# Altium project S7CAS-PLEIADES-CARTE-MERE-P_07.PrjPcb (part 2 of 2)

## Sheet ADC_1_PLEIADES.SchDoc
size Tabloid; SheetNumber: 9; SheetTotal: 10; Sheet_Name: Insert name in Document Parameters; Size: 11x17
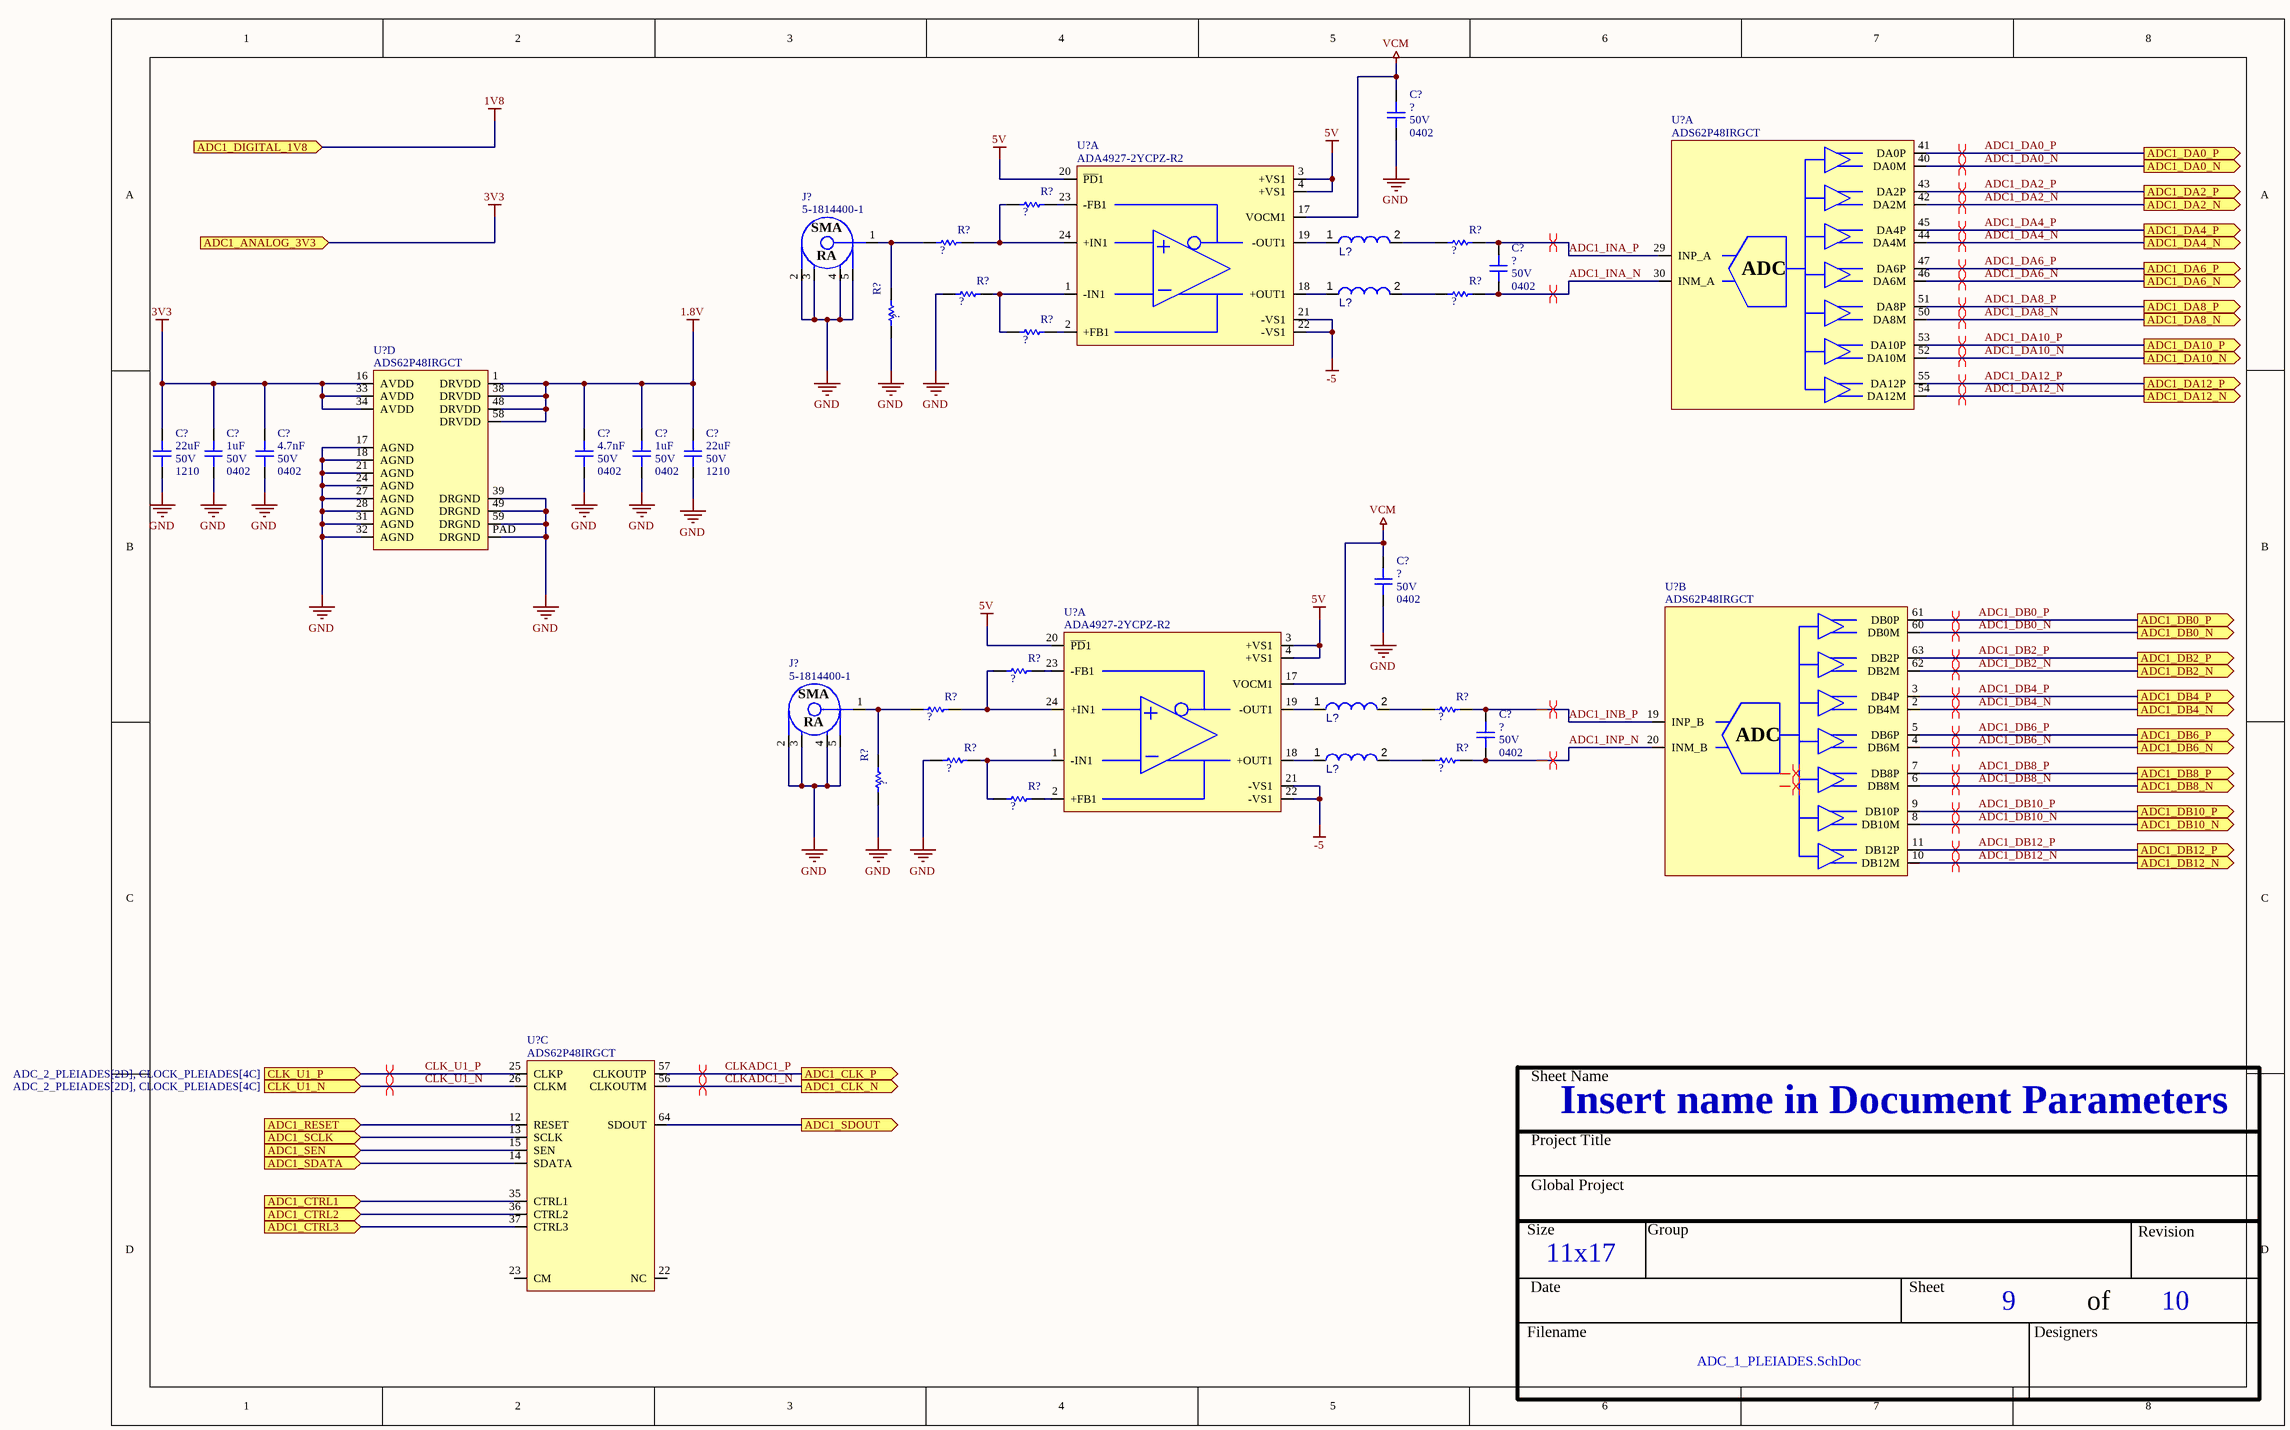
[diagram p7: ADC_1_PLEIADES.SchDoc]

### Parts
(Parts that share a designator on the sheet are numbered #1, #2 ... from top to bottom, then left to right.)
C?#15  Voltage: 50V  Package: 0402  [CAP_0402]  (hidden comment: CAP - 0402)
C?#16  Voltage: 50V  Package: 0402  [CAP_0402]  (hidden comment: CAP - 0402)
C?#17  value 22uF  Voltage: 50V  Package: 1210  [CAP_1210]  (hidden comment: CAP - 1210)
C?#18  value 1uF  Voltage: 50V  Package: 0402  [CAP_0402]  (hidden comment: CAP - 0402)
C?#19  value 4.7nF  Voltage: 50V  Package: 0402  [CAP_0402]  (hidden comment: CAP - 0402)
C?#20  value 4.7nF  Voltage: 50V  Package: 0402  [CAP_0402]  (hidden comment: CAP - 0402)
C?#21  value 1uF  Voltage: 50V  Package: 0402  [CAP_0402]  (hidden comment: CAP - 0402)
C?#22  value 22uF  Voltage: 50V  Package: 1210  [CAP_1210]  (hidden comment: CAP - 1210)
C?#23  Voltage: 50V  Package: 0402  [CAP_0402]  (hidden comment: CAP - 0402)
C?#24  Voltage: 50V  Package: 0402  [CAP_0402]  (hidden comment: CAP - 0402)
J?#2  5-1814400-1  [CONN_SMA_5-1814400-1]
J?#3  5-1814400-1  [CONN_SMA_5-1814400-1]
L?#3  RL622-102K-RC  [INDR62-500-1100X850X1100]  (value not drawn)
L?#4  RL622-102K-RC  [INDR62-500-1100X850X1100]  (value not drawn)
L?#5  RL622-102K-RC  [INDR62-500-1100X850X1100]  (value not drawn)
L?#6  RL622-102K-RC  [INDR62-500-1100X850X1100]  (value not drawn)
R?#5  RES - 0402  [RES_0402]  (value not drawn)
R?#6  RES - 0402  [RES_0402]  (value not drawn)
R?#7  RES - 0402  [RES_0402]  (value not drawn)
R?#8  RES - 0402  [RES_0402]  (value not drawn)
R?#9  RES - 0402  [RES_0402]  (value not drawn)
R?#10  RES - 0402  [RES_0402]  (value not drawn)
R?#11  RES - 0402  [RES_0402]  (value not drawn)
R?#12  RES - 0402  [RES_0402]  (value not drawn)
R?#13  RES - 0402  [RES_0402]  (value not drawn)
R?#14  RES - 0402  [RES_0402]  (value not drawn)
R?#15  RES - 0402  [RES_0402]  (value not drawn)
R?#16  RES - 0402  [RES_0402]  (value not drawn)
R?#17  RES - 0402  [RES_0402]  (value not drawn)
R?#18  RES - 0402  [RES_0402]  (value not drawn)
U?#12  ADS62P48IRGCT  [ADC_ADS62P48IRGCT]  (part A of 4)
U?#13  ADA4927-2YCPZ-R2  [OPAMP_ADA4927-2YCPZ-R2]  (part A of 2)
U?#14  ADS62P48IRGCT  [ADC_ADS62P48IRGCT]  (part D of 4)
U?#15  ADS62P48IRGCT  [ADC_ADS62P48IRGCT]  (part B of 4)
U?#16  ADA4927-2YCPZ-R2  [OPAMP_ADA4927-2YCPZ-R2]  (part A of 2)
U?#17  ADS62P48IRGCT  [ADC_ADS62P48IRGCT]  (part C of 4)

### Ports
ADC1_ANALOG_3V3 (in), ADC1_CLK_N (out), ADC1_CLK_P (out), ADC1_CTRL1 (in), ADC1_CTRL2 (in), ADC1_CTRL3 (in), ADC1_DA0_N (out), ADC1_DA0_P (out), ADC1_DA2_N (out), ADC1_DA2_P (out), ADC1_DA4_N (out), ADC1_DA4_P (out), ADC1_DA6_N (out), ADC1_DA6_P (out), ADC1_DA8_N (out), ADC1_DA8_P (out), ADC1_DA10_N (out), ADC1_DA10_P (out), ADC1_DA12_N (out), ADC1_DA12_P (out), ADC1_DB0_N (out), ADC1_DB0_P (out), ADC1_DB2_N (out), ADC1_DB2_P (out), ADC1_DB4_N (out), ADC1_DB4_P (out), ADC1_DB6_N (out), ADC1_DB6_P (out), ADC1_DB8_N (out), ADC1_DB8_P (out), ADC1_DB10_N (out), ADC1_DB10_P (out), ADC1_DB12_N (out), ADC1_DB12_P (out), ADC1_DIGITAL_1V8 (in), ADC1_RESET (in), ADC1_SCLK (in), ADC1_SDATA (in), ADC1_SDOUT (out), ADC1_SEN (in), CLK_U1_N (in, see ADC_2_PLEIADES[2D], CLOCK_PLEIADES[4C]), CLK_U1_P (in, see ADC_2_PLEIADES[2D], CLOCK_PLEIADES[4C])

### Nets
1.8V: C?#20.2 C?#21.2 C?#22.2 U?#14.1(DRVDD) U?#14.38(DRVDD) U?#14.48(DRVDD) U?#14.58(DRVDD)
1V8: port ADC1_DIGITAL_1V8
3V3: C?#15.1 C?#17.1 C?#17.2 C?#18.1 C?#18.2 C?#19.1 C?#19.2 C?#20.1 C?#21.1 C?#22.1 C?#23.1 J?#2.2 J?#2.3 J?#2.4 J?#2.5 J?#3.2 J?#3.3 J?#3.4 J?#3.5 R?#8.1 R?#10.1 R?#15.1 R?#17.1 U?#14.16(AVDD) U?#14.17(AGND) U?#14.18(AGND) U?#14.21(AGND) U?#14.24(AGND) U?#14.27(AGND) U?#14.28(AGND) U?#14.31(AGND) U?#14.32(AGND) U?#14.33(AVDD) U?#14.34(AVDD) U?#14.39(DRGND) U?#14.49(DRGND) U?#14.59(DRGND) U?#14.PAD(DRGND) ; port ADC1_ANALOG_3V3  [also labelled GND]  [project net +0V75]
5V: U?#13.3(+VS1) U?#13.4(+VS1) U?#13.20(~{PD}1) U?#16.3(+VS1) U?#16.4(+VS1) U?#16.20(~{PD}1)
-5: U?#13.21(-VS1) U?#13.22(-VS1) U?#16.21(-VS1) U?#16.22(-VS1)
VCM: C?#15.2 C?#23.2 U?#13.17(VOCM1) U?#16.17(VOCM1)
ADC1_DA0_N: U?#12.40(DA0M) ; port ADC1_DA0_N
ADC1_DA0_P: U?#12.41(DA0P) ; port ADC1_DA0_P
ADC1_DA2_N: U?#12.42(DA2M) ; port ADC1_DA2_N
ADC1_DA2_P: U?#12.43(DA2P) ; port ADC1_DA2_P
ADC1_DA4_N: U?#12.44(DA4M) ; port ADC1_DA4_N
ADC1_DA4_P: U?#12.45(DA4P) ; port ADC1_DA4_P
ADC1_DA6_N: U?#12.46(DA6M) ; port ADC1_DA6_N
ADC1_DA6_P: U?#12.47(DA6P) ; port ADC1_DA6_P
ADC1_DA8_N: U?#12.50(DA8M) ; port ADC1_DA8_N
ADC1_DA8_P: U?#12.51(DA8P) ; port ADC1_DA8_P
ADC1_DA10_N: U?#12.52(DA10M) ; port ADC1_DA10_N
ADC1_DA10_P: U?#12.53(DA10P) ; port ADC1_DA10_P
ADC1_DA12_N: U?#12.54(DA12M) ; port ADC1_DA12_N
ADC1_DA12_P: U?#12.55(DA12P) ; port ADC1_DA12_P
ADC1_DB0_N: U?#15.60(DB0M) ; port ADC1_DB0_N
ADC1_DB0_P: U?#15.61(DB0P) ; port ADC1_DB0_P
ADC1_DB2_N: U?#15.62(DB2M) ; port ADC1_DB2_N
ADC1_DB2_P: U?#15.63(DB2P) ; port ADC1_DB2_P
ADC1_DB4_N: U?#15.2(DB4M) ; port ADC1_DB4_N
ADC1_DB4_P: U?#15.3(DB4P) ; port ADC1_DB4_P
ADC1_DB6_N: U?#15.4(DB6M) ; port ADC1_DB6_N
ADC1_DB6_P: U?#15.5(DB6P) ; port ADC1_DB6_P
ADC1_DB8_N: U?#15.6(DB8M) ; port ADC1_DB8_N
ADC1_DB8_P: U?#15.7(DB8P) ; port ADC1_DB8_P
ADC1_DB10_N: U?#15.8(DB10M) ; port ADC1_DB10_N
ADC1_DB10_P: U?#15.9(DB10P) ; port ADC1_DB10_P
ADC1_DB12_N: U?#15.10(DB12M) ; port ADC1_DB12_N
ADC1_DB12_P: U?#15.11(DB12P) ; port ADC1_DB12_P
ADC1_INA_N: C?#16.1 R?#9.2 U?#12.30(INM_A)
ADC1_INA_P: C?#16.2 R?#7.2 U?#12.29(INP_A)
ADC1_INB_P: C?#24.2 R?#14.2 U?#15.19(INP_B)
ADC1_INP_N: C?#24.1 R?#16.2 U?#15.20(INM_B)
CLK_U1_N: U?#17.26(CLKM) ; port CLK_U1_N
CLK_U1_P: U?#17.25(CLKP) ; port CLK_U1_P
CLKADC1_N: U?#17.56(CLKOUTM) ; port ADC1_CLK_N
CLKADC1_P: U?#17.57(CLKOUTP) ; port ADC1_CLK_P
NetJ?#2_1: J?#2.1 R?#6.1 R?#10.2
NetJ?#3_1: J?#3.1 R?#13.1 R?#17.2
NetL?#3_1: L?#3.1 U?#13.19(-OUT1)
NetL?#3_2: L?#3.2 R?#7.1
NetL?#4_1: L?#4.1 U?#13.18(+OUT1)
NetL?#4_2: L?#4.2 R?#9.1
NetL?#5_1: L?#5.1 U?#16.19(-OUT1)
NetL?#5_2: L?#5.2 R?#14.1
NetL?#6_1: L?#6.1 U?#16.18(+OUT1)
NetL?#6_2: L?#6.2 R?#16.1
NetR?#5_1: R?#5.1 R?#6.2 U?#13.24(+IN1)
NetR?#5_2: R?#5.2 U?#13.23(-FB1)
NetR?#8_2: R?#8.2 R?#11.1 U?#13.1(-IN1)
NetR?#11_2: R?#11.2 U?#13.2(+FB1)
NetR?#12_1: R?#12.1 R?#13.2 U?#16.24(+IN1)
NetR?#12_2: R?#12.2 U?#16.23(-FB1)
NetR?#15_2: R?#15.2 R?#18.1 U?#16.1(-IN1)
NetR?#18_2: R?#18.2 U?#16.2(+FB1)
NetU?#17_12: U?#17.12(RESET) ; port ADC1_RESET
NetU?#17_13: U?#17.13(SCLK) ; port ADC1_SCLK
NetU?#17_14: U?#17.14(SDATA) ; port ADC1_SDATA
NetU?#17_15: U?#17.15(SEN) ; port ADC1_SEN
NetU?#17_35: U?#17.35(CTRL1) ; port ADC1_CTRL1
NetU?#17_36: U?#17.36(CTRL2) ; port ADC1_CTRL2
NetU?#17_37: U?#17.37(CTRL3) ; port ADC1_CTRL3
NetU?#17_64: U?#17.64(SDOUT) ; port ADC1_SDOUT

Not connected (* = marked no-connect by the designer): U?#17 22(NC) 23(CM)

### Layout directives
differential pair: (no net found under the mark), ADC1_DA0_N, ADC1_DA0_P, ADC1_DA2_N, ADC1_DA2_P, ADC1_DA4_N, ADC1_DA4_P, ADC1_DA6_N, ADC1_DA6_P, ADC1_DA8_N, ADC1_DA8_P, ADC1_DA10_N, ADC1_DA10_P, ADC1_DA12_N, ADC1_DA12_P, ADC1_DB0_N, ADC1_DB0_P, ADC1_DB2_N, ADC1_DB2_P, ADC1_DB4_N, ADC1_DB4_P, ADC1_DB6_N, ADC1_DB6_P, ADC1_DB8_N, ADC1_DB8_P, ADC1_DB10_N, ADC1_DB10_P, ADC1_DB12_N, ADC1_DB12_P, ADC1_INA_N, ADC1_INA_P, ADC1_INB_P, ADC1_INP_N, CLK_U1_N, CLK_U1_P, CLKADC1_N, CLKADC1_P

### Notes on the sheet
- Sheet Name
- Project Title
- Global Project
- Size
- Group
- Revision
- Date
- Sheet
- of
- Filename
- Designers
- (in symbol ADC_ADS62P48IRGCT, part A) ADC
- (in symbol ADC_ADS62P48IRGCT, part B) ADC
- (in symbol CONN_SMA_5-1814400-1) SMA; RA

### Library data of the parts
C?#15 C?#16 C?#18-C?#21 C?#23 C?#24 = CAP - 0402: Precision: 10%; Current: *; CreatedBy: Jonathan Bouchard; Power: *
  C?#15 C?#16 C?#23 C?#24: Value: ?
C?#17 C?#22 = CAP - 1210: Precision: 10%; Current: *; CreatedBy: Jonathan Bouchard; Power: *
J?#2 J?#3 = CONN_SMA_5-1814400-1: CONN -  SMA JACK R/A 50 OHM - TH; Mfg: TE Connectivity AMP Connectors; Voltage: *; Current: *; Power: *; Mfg Part Number: 5-1814400-1; HelpURL: http://www.te.com/commerce/DocumentDelivery/DDEController?Action=srchrtrv&DocNm=1814400&DocType=Customer+Drawing&DocLang=English; CreatedBy: Jonathan Bouchard; Temperature: -55°C ~ 85°C; Value: *; Precision: *; Package: TH-5; Supplier 1: Digikey; Supplier Part Number 1: A97593-ND
L?#3-L?#6 = CMP-006-00014-6: Radial Inductor, 1 mH, +/- 10%, 290 mA, -55 to 105 degC, 2-Pin THD, RoHS, Bulk; Manufacturer: Bourns; Shielding: Unshielded; Self Resonant Frequency: 1.3MHz; Core Material: Ferrite; Q Factor: 50; Current Rating: 290mA; Resistance: 2.9Ohm; Tolerance: 10%; Package Reference: INDR62-500-1100X850X1100; Mounting Technology: TH; Lead Pitch: 5mm; Packaging: Bulk; Package Description: 2-Pin Radial Lead, Dia 8.5 mm, Pitch 5 mm; Max Operating Temperature: 105°C; Package Quantity: 100; Datasheet URL: https://www.bourns.com/pdfs/rl622_series.pdf; Inductance Tolerance: 10%; Datasheet Version: Aug-10; Pins: 2; Case/Package: Radial; Diameter: 8.5mm; Min Operating Temperature: -55°C; RoHS Compliant: True
R?#5-R?#18 = RES - 0402: as R_FLASH_CCLK1 on sheet FPGA_2_PLEIADES; Current: *; CreatedBy: Jonathan Bouchard; Package: 0402; Value: ?
U?#12 U?#14 U?#15 U?#17 = ADC_ADS62P48IRGCT: ADC - 14 BIT 210MSPS SUAL - VQFN-64; Voltage: 3.15 V ~ 3.6 V / 1.7 V ~ 1.9 V; Mfg: Texas Instruments; Precision: 14 Bit; Current: *; Power: *; Mfg Part Number: ADS62P48IRGCT; HelpURL: http://www.ti.com/lit/ds/symlink/ads62p48.pdf; CreatedBy: Jonathan Bouchard; Temperature: -40°C ~ 85°C; Value: *; Package: VQFN-64; Supplier 1: Digikey; Supplier Part Number 1: 296-24611-1-ND
U?#13 U?#16 = OPAMP_ADA4927-2YCPZ-R2: OPAMP - CFA 2.3GHZ - QFN-24; Voltage: 4.5 V ~ 11 V, ±2.25 V ~ 5.5 V; Current: 65mA; Mfg: Analog Devices; Power: *; Mfg Part Number: ADA4927-2YCPZ-R2; HelpURL: http://www.analog.com/media/en/technical-documentation/data-sheets/ADA4927-1_4927-2.pdf; CreatedBy: Jonathan Bouchard; Temperature: -40°C ~ 105°C; Value: *; Precision: *; Package: QFN-24; Supplier 1: Digikey; Supplier Part Number 1: ADA4927-2YCPZ-R2CT-ND

## Sheet ADC_2_PLEIADES.SchDoc
size Tabloid; SheetNumber: 10; SheetTotal: 10; Sheet_Name: Insert name in Document Parameters; Size: 11x17
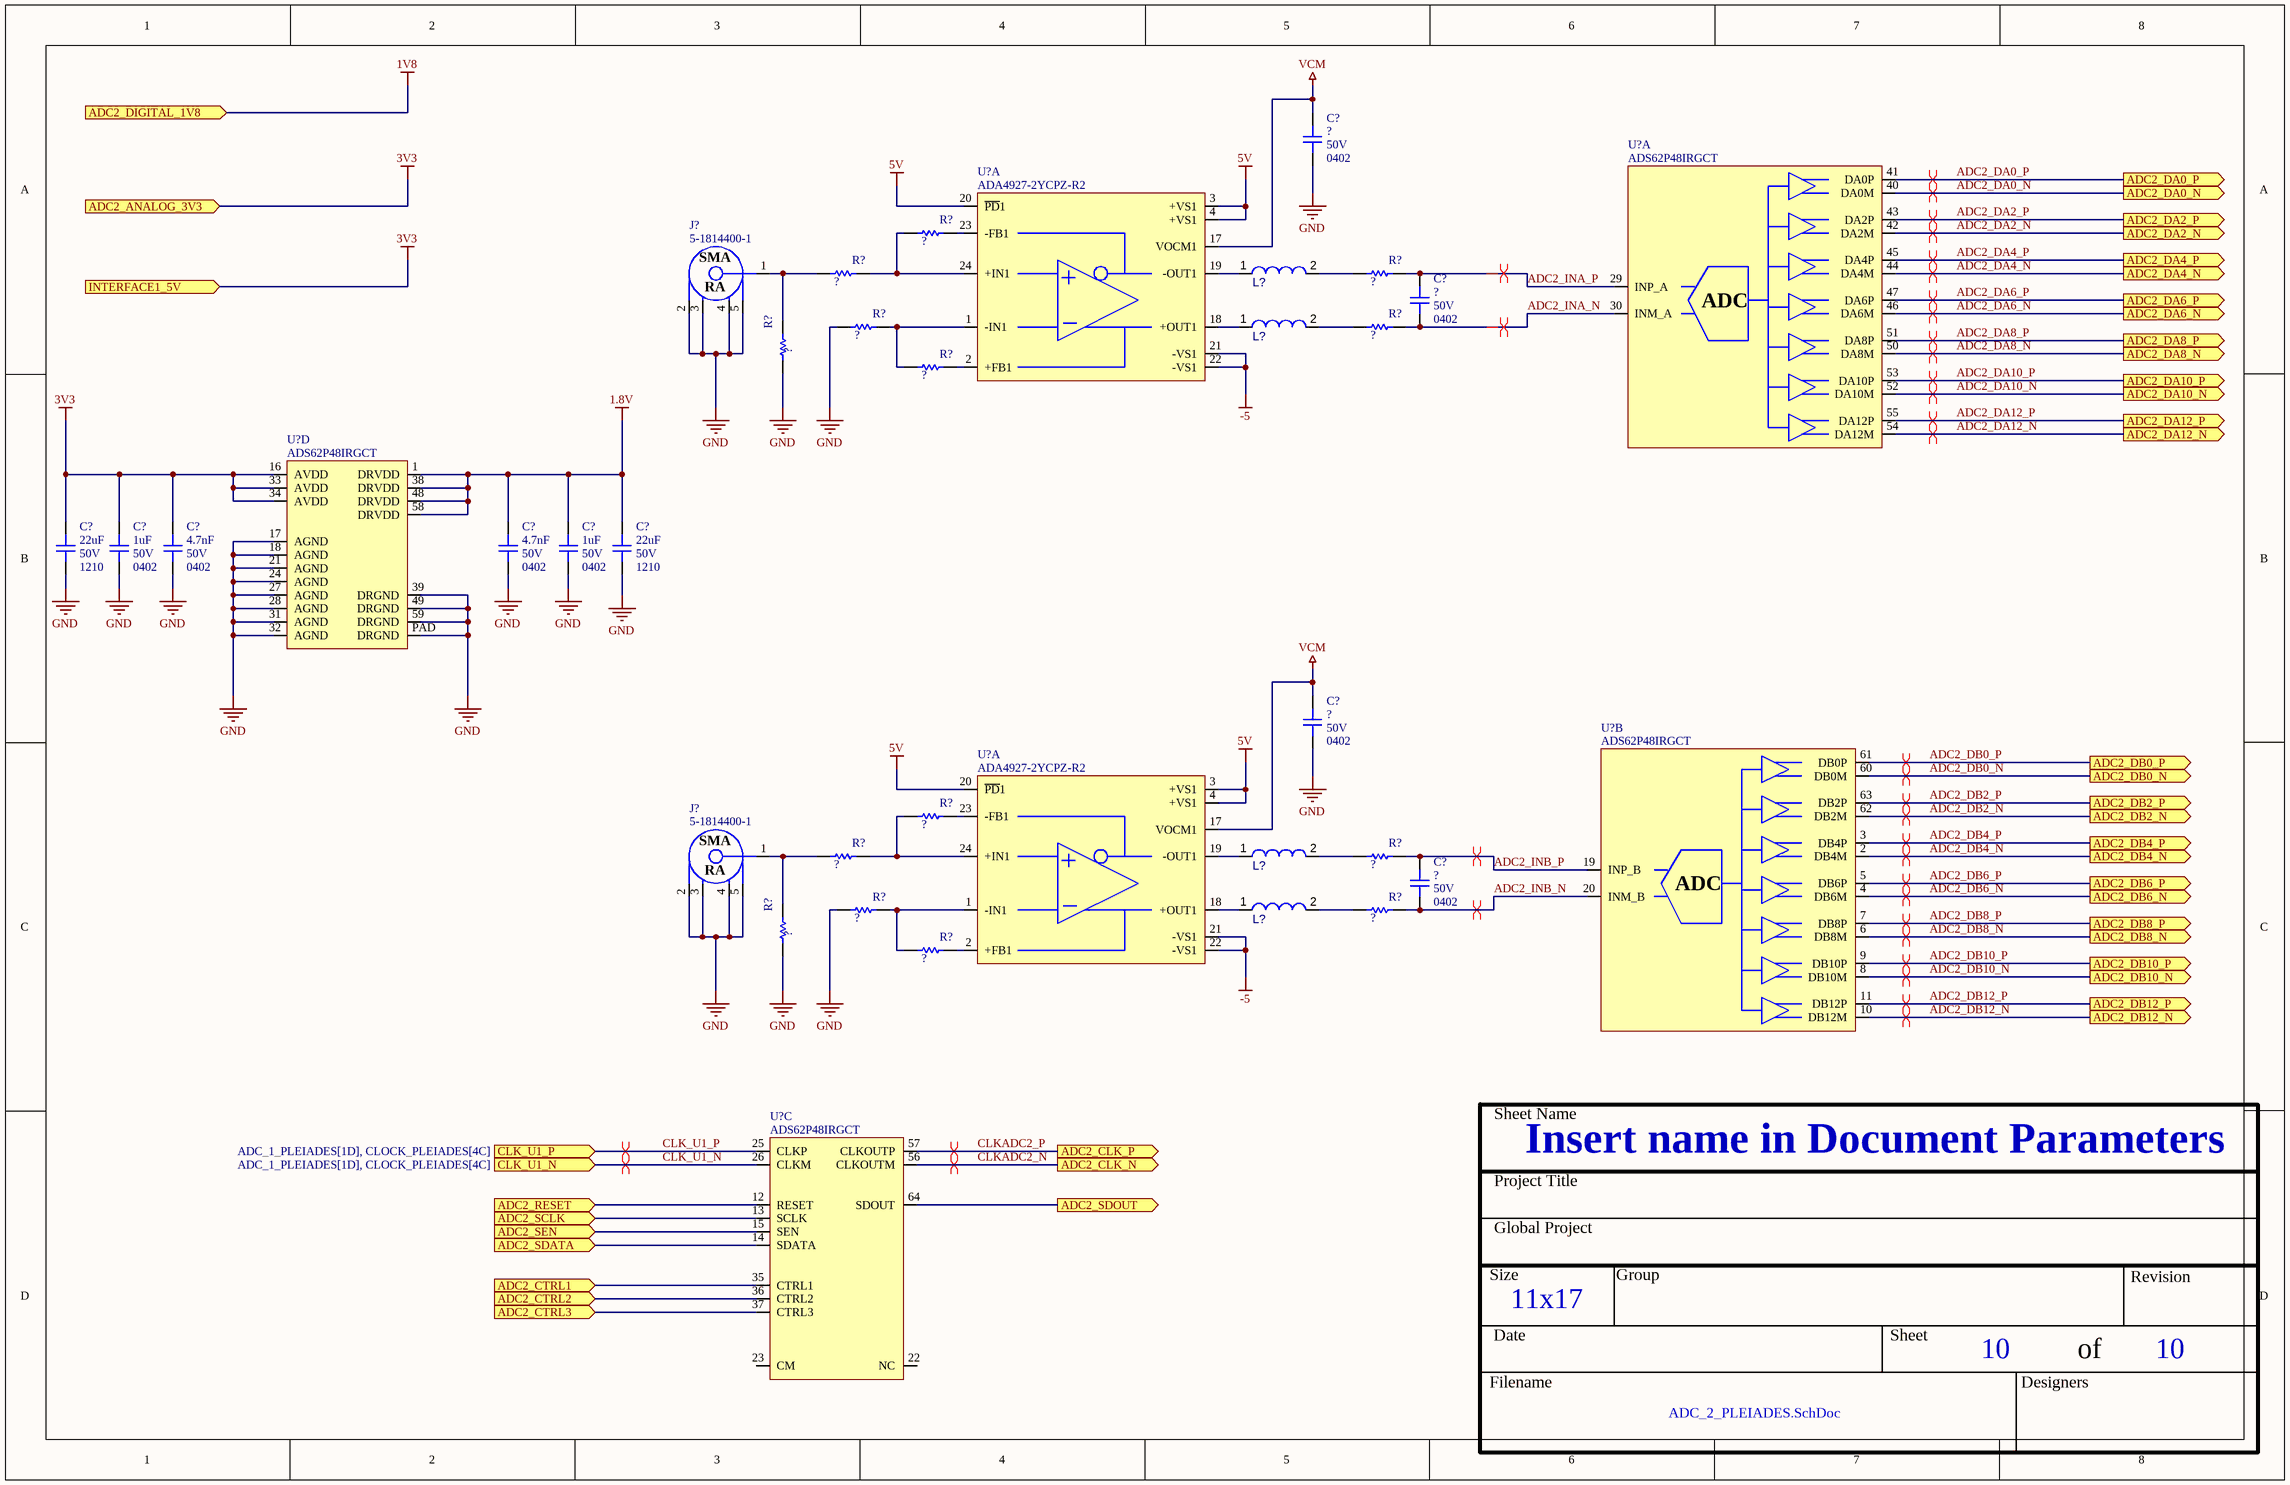
[diagram p8: ADC_2_PLEIADES.SchDoc]

### Parts
(Parts that share a designator on the sheet are numbered #1, #2 ... from top to bottom, then left to right.)
C?#25  Voltage: 50V  Package: 0402  [CAP_0402]  (hidden comment: CAP - 0402)
C?#26  Voltage: 50V  Package: 0402  [CAP_0402]  (hidden comment: CAP - 0402)
C?#27  value 22uF  Voltage: 50V  Package: 1210  [CAP_1210]  (hidden comment: CAP - 1210)
C?#28  value 1uF  Voltage: 50V  Package: 0402  [CAP_0402]  (hidden comment: CAP - 0402)
C?#29  value 4.7nF  Voltage: 50V  Package: 0402  [CAP_0402]  (hidden comment: CAP - 0402)
C?#30  value 4.7nF  Voltage: 50V  Package: 0402  [CAP_0402]  (hidden comment: CAP - 0402)
C?#31  value 1uF  Voltage: 50V  Package: 0402  [CAP_0402]  (hidden comment: CAP - 0402)
C?#32  value 22uF  Voltage: 50V  Package: 1210  [CAP_1210]  (hidden comment: CAP - 1210)
C?#33  Voltage: 50V  Package: 0402  [CAP_0402]  (hidden comment: CAP - 0402)
C?#34  Voltage: 50V  Package: 0402  [CAP_0402]  (hidden comment: CAP - 0402)
J?#4  5-1814400-1  [CONN_SMA_5-1814400-1]
J?#5  5-1814400-1  [CONN_SMA_5-1814400-1]
L?#7  RL622-102K-RC  [INDR62-500-1100X850X1100]  (value not drawn)
L?#8  RL622-102K-RC  [INDR62-500-1100X850X1100]  (value not drawn)
L?#9  RL622-102K-RC  [INDR62-500-1100X850X1100]  (value not drawn)
L?#10  RL622-102K-RC  [INDR62-500-1100X850X1100]  (value not drawn)
R?#19  RES - 0402  [RES_0402]  (value not drawn)
R?#20  RES - 0402  [RES_0402]  (value not drawn)
R?#21  RES - 0402  [RES_0402]  (value not drawn)
R?#22  RES - 0402  [RES_0402]  (value not drawn)
R?#23  RES - 0402  [RES_0402]  (value not drawn)
R?#24  RES - 0402  [RES_0402]  (value not drawn)
R?#25  RES - 0402  [RES_0402]  (value not drawn)
R?#26  RES - 0402  [RES_0402]  (value not drawn)
R?#27  RES - 0402  [RES_0402]  (value not drawn)
R?#28  RES - 0402  [RES_0402]  (value not drawn)
R?#29  RES - 0402  [RES_0402]  (value not drawn)
R?#30  RES - 0402  [RES_0402]  (value not drawn)
R?#31  RES - 0402  [RES_0402]  (value not drawn)
R?#32  RES - 0402  [RES_0402]  (value not drawn)
U?#18  ADS62P48IRGCT  [ADC_ADS62P48IRGCT]  (part A of 4)
U?#19  ADA4927-2YCPZ-R2  [OPAMP_ADA4927-2YCPZ-R2]  (part A of 2)
U?#20  ADS62P48IRGCT  [ADC_ADS62P48IRGCT]  (part D of 4)
U?#21  ADS62P48IRGCT  [ADC_ADS62P48IRGCT]  (part B of 4)
U?#22  ADA4927-2YCPZ-R2  [OPAMP_ADA4927-2YCPZ-R2]  (part A of 2)
U?#23  ADS62P48IRGCT  [ADC_ADS62P48IRGCT]  (part C of 4)

### Ports
ADC2_ANALOG_3V3 (in), ADC2_CLK_N (out), ADC2_CLK_P (out), ADC2_CTRL1 (in), ADC2_CTRL2 (in), ADC2_CTRL3 (in), ADC2_DA0_N (out), ADC2_DA0_P (out), ADC2_DA2_N (out), ADC2_DA2_P (out), ADC2_DA4_N (out), ADC2_DA4_P (out), ADC2_DA6_N (out), ADC2_DA6_P (out), ADC2_DA8_N (out), ADC2_DA8_P (out), ADC2_DA10_N (out), ADC2_DA10_P (out), ADC2_DA12_N (out), ADC2_DA12_P (out), ADC2_DB0_N (out), ADC2_DB0_P (out), ADC2_DB2_N (out), ADC2_DB2_P (out), ADC2_DB4_N (out), ADC2_DB4_P (out), ADC2_DB6_N (out), ADC2_DB6_P (out), ADC2_DB8_N (out), ADC2_DB8_P (out), ADC2_DB10_N (out), ADC2_DB10_P (out), ADC2_DB12_N (out), ADC2_DB12_P (out), ADC2_DIGITAL_1V8 (in), ADC2_RESET (in), ADC2_SCLK (in), ADC2_SDATA (in), ADC2_SDOUT (out), ADC2_SEN (in), CLK_U1_N (in, see ADC_1_PLEIADES[1D], CLOCK_PLEIADES[4C]), CLK_U1_P (in, see ADC_1_PLEIADES[1D], CLOCK_PLEIADES[4C]), INTERFACE1_5V (in)

### Nets
1.8V: C?#30.2 C?#31.2 C?#32.2 U?#20.1(DRVDD) U?#20.38(DRVDD) U?#20.48(DRVDD) U?#20.58(DRVDD)
1V8: port ADC2_DIGITAL_1V8
3V3: C?#25.1 C?#27.1 C?#27.2 C?#28.1 C?#28.2 C?#29.1 C?#29.2 C?#30.1 C?#31.1 C?#32.1 C?#33.1 J?#4.2 J?#4.3 J?#4.4 J?#4.5 J?#5.2 J?#5.3 J?#5.4 J?#5.5 R?#22.1 R?#24.1 R?#29.1 R?#31.1 U?#20.16(AVDD) U?#20.17(AGND) U?#20.18(AGND) U?#20.21(AGND) U?#20.24(AGND) U?#20.27(AGND) U?#20.28(AGND) U?#20.31(AGND) U?#20.32(AGND) U?#20.33(AVDD) U?#20.34(AVDD) U?#20.39(DRGND) U?#20.49(DRGND) U?#20.59(DRGND) U?#20.PAD(DRGND) ; port ADC2_ANALOG_3V3, port INTERFACE1_5V  [also labelled GND]  [project net +0V75]
5V: U?#19.3(+VS1) U?#19.4(+VS1) U?#19.20(~{PD}1) U?#22.3(+VS1) U?#22.4(+VS1) U?#22.20(~{PD}1)
-5: U?#19.21(-VS1) U?#19.22(-VS1) U?#22.21(-VS1) U?#22.22(-VS1)
VCM: C?#25.2 C?#33.2 U?#19.17(VOCM1) U?#22.17(VOCM1)
ADC2_DA0_N: U?#18.40(DA0M) ; port ADC2_DA0_N
ADC2_DA0_P: U?#18.41(DA0P) ; port ADC2_DA0_P
ADC2_DA2_N: U?#18.42(DA2M) ; port ADC2_DA2_N
ADC2_DA2_P: U?#18.43(DA2P) ; port ADC2_DA2_P
ADC2_DA4_N: U?#18.44(DA4M) ; port ADC2_DA4_N
ADC2_DA4_P: U?#18.45(DA4P) ; port ADC2_DA4_P
ADC2_DA6_N: U?#18.46(DA6M) ; port ADC2_DA6_N
ADC2_DA6_P: U?#18.47(DA6P) ; port ADC2_DA6_P
ADC2_DA8_N: U?#18.50(DA8M) ; port ADC2_DA8_N
ADC2_DA8_P: U?#18.51(DA8P) ; port ADC2_DA8_P
ADC2_DA10_N: U?#18.52(DA10M) ; port ADC2_DA10_N
ADC2_DA10_P: U?#18.53(DA10P) ; port ADC2_DA10_P
ADC2_DA12_N: U?#18.54(DA12M) ; port ADC2_DA12_N
ADC2_DA12_P: U?#18.55(DA12P) ; port ADC2_DA12_P
ADC2_DB0_N: U?#21.60(DB0M) ; port ADC2_DB0_N
ADC2_DB0_P: U?#21.61(DB0P) ; port ADC2_DB0_P
ADC2_DB2_N: U?#21.62(DB2M) ; port ADC2_DB2_N
ADC2_DB2_P: U?#21.63(DB2P) ; port ADC2_DB2_P
ADC2_DB4_N: U?#21.2(DB4M) ; port ADC2_DB4_N
ADC2_DB4_P: U?#21.3(DB4P) ; port ADC2_DB4_P
ADC2_DB6_N: U?#21.4(DB6M) ; port ADC2_DB6_N
ADC2_DB6_P: U?#21.5(DB6P) ; port ADC2_DB6_P
ADC2_DB8_N: U?#21.6(DB8M) ; port ADC2_DB8_N
ADC2_DB8_P: U?#21.7(DB8P) ; port ADC2_DB8_P
ADC2_DB10_N: U?#21.8(DB10M) ; port ADC2_DB10_N
ADC2_DB10_P: U?#21.9(DB10P) ; port ADC2_DB10_P
ADC2_DB12_N: U?#21.10(DB12M) ; port ADC2_DB12_N
ADC2_DB12_P: U?#21.11(DB12P) ; port ADC2_DB12_P
ADC2_INA_N: C?#26.1 R?#23.2 U?#18.30(INM_A)
ADC2_INA_P: C?#26.2 R?#21.2 U?#18.29(INP_A)
ADC2_INB_N: C?#34.1 R?#30.2 U?#21.20(INM_B)
ADC2_INB_P: C?#34.2 R?#28.2 U?#21.19(INP_B)
CLK_U1_N: U?#23.26(CLKM) ; port CLK_U1_N
CLK_U1_P: U?#23.25(CLKP) ; port CLK_U1_P
CLKADC2_N: U?#23.56(CLKOUTM) ; port ADC2_CLK_N
CLKADC2_P: U?#23.57(CLKOUTP) ; port ADC2_CLK_P
NetJ?#4_1: J?#4.1 R?#20.1 R?#24.2
NetJ?#5_1: J?#5.1 R?#27.1 R?#31.2
NetL?#7_1: L?#7.1 U?#19.19(-OUT1)
NetL?#7_2: L?#7.2 R?#21.1
NetL?#8_1: L?#8.1 U?#19.18(+OUT1)
NetL?#8_2: L?#8.2 R?#23.1
NetL?#9_1: L?#9.1 U?#22.19(-OUT1)
NetL?#9_2: L?#9.2 R?#28.1
NetL?#10_1: L?#10.1 U?#22.18(+OUT1)
NetL?#10_2: L?#10.2 R?#30.1
NetR?#19_1: R?#19.1 R?#20.2 U?#19.24(+IN1)
NetR?#19_2: R?#19.2 U?#19.23(-FB1)
NetR?#22_2: R?#22.2 R?#25.1 U?#19.1(-IN1)
NetR?#25_2: R?#25.2 U?#19.2(+FB1)
NetR?#26_1: R?#26.1 R?#27.2 U?#22.24(+IN1)
NetR?#26_2: R?#26.2 U?#22.23(-FB1)
NetR?#29_2: R?#29.2 R?#32.1 U?#22.1(-IN1)
NetR?#32_2: R?#32.2 U?#22.2(+FB1)
NetU?#23_12: U?#23.12(RESET) ; port ADC2_RESET
NetU?#23_13: U?#23.13(SCLK) ; port ADC2_SCLK
NetU?#23_14: U?#23.14(SDATA) ; port ADC2_SDATA
NetU?#23_15: U?#23.15(SEN) ; port ADC2_SEN
NetU?#23_35: U?#23.35(CTRL1) ; port ADC2_CTRL1
NetU?#23_36: U?#23.36(CTRL2) ; port ADC2_CTRL2
NetU?#23_37: U?#23.37(CTRL3) ; port ADC2_CTRL3
NetU?#23_64: U?#23.64(SDOUT) ; port ADC2_SDOUT

Not connected (* = marked no-connect by the designer): U?#23 22(NC) 23(CM)

### Layout directives
differential pair: ADC2_DA0_N, ADC2_DA0_P, ADC2_DA2_N, ADC2_DA2_P, ADC2_DA4_N, ADC2_DA4_P, ADC2_DA6_N, ADC2_DA6_P, ADC2_DA8_N, ADC2_DA8_P, ADC2_DA10_N, ADC2_DA10_P, ADC2_DA12_N, ADC2_DA12_P, ADC2_DB0_N, ADC2_DB0_P, ADC2_DB2_N, ADC2_DB2_P, ADC2_DB4_N, ADC2_DB4_P, ADC2_DB6_N, ADC2_DB6_P, ADC2_DB8_N, ADC2_DB8_P, ADC2_DB10_N, ADC2_DB10_P, ADC2_DB12_N, ADC2_DB12_P, ADC2_INA_N, ADC2_INA_P, ADC2_INB_N, ADC2_INB_P, CLK_U1_N, CLK_U1_P, CLKADC2_N, CLKADC2_P

### Notes on the sheet
- Sheet Name
- Project Title
- Global Project
- Size
- Group
- Revision
- Date
- Sheet
- of
- Filename
- Designers
- (in symbol ADC_ADS62P48IRGCT, part A) ADC
- (in symbol ADC_ADS62P48IRGCT, part B) ADC
- (in symbol CONN_SMA_5-1814400-1) SMA; RA

### Library data of the parts
C?#25 C?#26 C?#28-C?#31 C?#33 C?#34 = CAP - 0402: Precision: 10%; Current: *; CreatedBy: Jonathan Bouchard; Power: *
  C?#25 C?#26 C?#33 C?#34: Value: ?
C?#27 C?#32 = CAP - 1210: Precision: 10%; Current: *; CreatedBy: Jonathan Bouchard; Power: *
J?#4 J?#5 = CONN_SMA_5-1814400-1: CONN -  SMA JACK R/A 50 OHM - TH; Mfg: TE Connectivity AMP Connectors; Voltage: *; Current: *; Power: *; Mfg Part Number: 5-1814400-1; HelpURL: http://www.te.com/commerce/DocumentDelivery/DDEController?Action=srchrtrv&DocNm=1814400&DocType=Customer+Drawing&DocLang=English; CreatedBy: Jonathan Bouchard; Temperature: -55°C ~ 85°C; Value: *; Precision: *; Package: TH-5; Supplier 1: Digikey; Supplier Part Number 1: A97593-ND
L?#7-L?#10 = CMP-006-00014-6: Radial Inductor, 1 mH, +/- 10%, 290 mA, -55 to 105 degC, 2-Pin THD, RoHS, Bulk; Manufacturer: Bourns; Shielding: Unshielded; Self Resonant Frequency: 1.3MHz; Core Material: Ferrite; Q Factor: 50; Current Rating: 290mA; Resistance: 2.9Ohm; Tolerance: 10%; Package Reference: INDR62-500-1100X850X1100; Mounting Technology: TH; Lead Pitch: 5mm; Packaging: Bulk; Package Description: 2-Pin Radial Lead, Dia 8.5 mm, Pitch 5 mm; Max Operating Temperature: 105°C; Package Quantity: 100; Datasheet URL: https://www.bourns.com/pdfs/rl622_series.pdf; Inductance Tolerance: 10%; Datasheet Version: Aug-10; Pins: 2; Case/Package: Radial; Diameter: 8.5mm; Min Operating Temperature: -55°C; RoHS Compliant: True
R?#19-R?#32 = RES - 0402: Voltage: 50V; Power: 1/16W; Precision: 1%; Current: *; CreatedBy: Jonathan Bouchard; Package: 0402; Value: ?
U?#18 U?#20 U?#21 U?#23 = ADC_ADS62P48IRGCT: ADC - 14 BIT 210MSPS SUAL - VQFN-64; Voltage: 3.15 V ~ 3.6 V / 1.7 V ~ 1.9 V; Mfg: Texas Instruments; Precision: 14 Bit; Current: *; Power: *; Mfg Part Number: ADS62P48IRGCT; HelpURL: http://www.ti.com/lit/ds/symlink/ads62p48.pdf; CreatedBy: Jonathan Bouchard; Temperature: -40°C ~ 85°C; Value: *; Package: VQFN-64; Supplier 1: Digikey; Supplier Part Number 1: 296-24611-1-ND
U?#19 U?#22 = OPAMP_ADA4927-2YCPZ-R2: OPAMP - CFA 2.3GHZ - QFN-24; Voltage: 4.5 V ~ 11 V, ±2.25 V ~ 5.5 V; Current: 65mA; Mfg: Analog Devices; Power: *; Mfg Part Number: ADA4927-2YCPZ-R2; HelpURL: http://www.analog.com/media/en/technical-documentation/data-sheets/ADA4927-1_4927-2.pdf; CreatedBy: Jonathan Bouchard; Temperature: -40°C ~ 105°C; Value: *; Precision: *; Package: QFN-24; Supplier 1: Digikey; Supplier Part Number 1: ADA4927-2YCPZ-R2CT-ND

## Nets that join several sheets
1.8V: ADC_1_PLEIADES (7 pins), ADC_2_PLEIADES (7 pins)
5V: ADC_1_PLEIADES (6 pins), ADC_2_PLEIADES (6 pins)
+0V75: FPGA_2_PLEIADES (R_FLASH_CCLK2.1 R_ZK.1 U?#5.4), USB_PLEIADES (20 pins), CLOCK_PLEIADES (30 pins), ETHERNET_PLEIADES (34 pins), DDR3_PLEIADES (40 pins), ADC_1_PLEIADES (38 pins), ADC_2_PLEIADES (38 pins)
-5: ADC_1_PLEIADES (U?#13.21 U?#13.22 U?#16.21 U?#16.22), ADC_2_PLEIADES (U?#19.21 U?#19.22 U?#22.21 U?#22.22)
VCM: ADC_1_PLEIADES (C?#15.2 C?#23.2 U?#13.17 U?#16.17), ADC_2_PLEIADES (C?#25.2 C?#33.2 U?#19.17 U?#22.17)
CLK_U1_N: CLOCK_PLEIADES (U?#8.20), ADC_1_PLEIADES (U?#17.26), ADC_2_PLEIADES (U?#23.26)
CLK_U1_P: CLOCK_PLEIADES (U?#8.19), ADC_1_PLEIADES (U?#17.25), ADC_2_PLEIADES (U?#23.25)
CLK_U2_N: FPGA_2_PLEIADES (U?#3.AD13), CLOCK_PLEIADES (U?#8.17)
CLK_U2_P: FPGA_2_PLEIADES (U?#3.AC13), CLOCK_PLEIADES (U?#8.16)
DDR3_CK_N: FPGA_2_PLEIADES (U?#4.R3), DDR3_PLEIADES (R_CK_N?.2 U?#11.K7)
DDR3_CK_P: FPGA_2_PLEIADES (U?#4.R4), DDR3_PLEIADES (R_CK_P?.2 U?#11.J7)
DDR3_LDQS_N: FPGA_2_PLEIADES (U?#4.V1), DDR3_PLEIADES (U?#11.G3)
DDR3_LDQS_P: FPGA_2_PLEIADES (U?#4.V3), DDR3_PLEIADES (U?#11.F3)
DDR3_UDQS_N: FPGA_2_PLEIADES (U?#4.AC1), DDR3_PLEIADES (U?#11.B7)
DDR3_UDQS_P: FPGA_2_PLEIADES (U?#4.AC2), DDR3_PLEIADES (U?#11.C7)
NetD_RST#2_2: FPGA_2_PLEIADES (U?#3.Y18), ETHERNET_PLEIADES (D_RST#2.2)
NetM??#1_5: FPGA_2_PLEIADES (U?#3.AA14), USB_PLEIADES (M??#1.5)
NetM??#1_6: FPGA_2_PLEIADES (U?#3.Y14), USB_PLEIADES (M??#1.6)
NetM??#1_10: FPGA_PLEIADES (U?#1.E21), USB_PLEIADES (M??#1.10)
NetM??#1_11: FPGA_PLEIADES (U?#1.A24), USB_PLEIADES (M??#1.11)
NetM??#1_12: FPGA_PLEIADES (U?#1.F20), USB_PLEIADES (M??#1.12)
NetM??#1_13: FPGA_PLEIADES (U?#1.C23), USB_PLEIADES (M??#1.13)
NetR_A?#1_1: FPGA_2_PLEIADES (U?#4.M6), DDR3_PLEIADES (R_A?#1.1 U?#11.T3)
NetR_A?#2_1: FPGA_2_PLEIADES (U?#4.L3), DDR3_PLEIADES (R_A?#2.1 U?#11.R7)
NetR_A?#3_1: FPGA_2_PLEIADES (U?#4.N3), DDR3_PLEIADES (R_A?#3.1 U?#11.R3)
NetR_A?#4_1: FPGA_2_PLEIADES (U?#4.P10), DDR3_PLEIADES (R_A?#4.1 U?#11.R2)
NetR_A?#5_1: FPGA_2_PLEIADES (U?#4.R2), DDR3_PLEIADES (R_A?#5.1 U?#11.P2)
NetR_A?#6_1: FPGA_2_PLEIADES (U?#4.P7), DDR3_PLEIADES (R_A?#6.1 U?#11.N2)
NetR_A?#7_1: FPGA_2_PLEIADES (U?#4.N6), DDR3_PLEIADES (R_A?#7.1 U?#11.P7)
NetR_A?#8_1: FPGA_2_PLEIADES (U?#4.M8), DDR3_PLEIADES (R_A?#8.1 U?#11.N7)
NetR_A?#9_1: FPGA_2_PLEIADES (U?#4.M10), DDR3_PLEIADES (R_A?#9.1 U?#11.L7)
NetR_A?#10_1: FPGA_2_PLEIADES (U?#4.N4), DDR3_PLEIADES (R_A?#10.1 U?#11.T8)
NetR_A?#11_1: FPGA_2_PLEIADES (U?#4.R1), DDR3_PLEIADES (R_A?#11.1 U?#11.R8)
NetR_A?#12_1: FPGA_2_PLEIADES (U?#4.N9), DDR3_PLEIADES (R_A?#12.1 U?#11.P8)
NetR_A?#13_1: FPGA_2_PLEIADES (U?#4.R9), DDR3_PLEIADES (R_A?#13.1 U?#11.P3)
NetR_A?#14_1: FPGA_2_PLEIADES (U?#4.N7), DDR3_PLEIADES (R_A?#14.1 U?#11.N3)
NetR_BA?#1_1: FPGA_2_PLEIADES (U?#4.N5), DDR3_PLEIADES (R_BA?#1.1 U?#11.M3)
NetR_BA?#2_1: FPGA_2_PLEIADES (U?#4.P1), DDR3_PLEIADES (R_BA?#2.1 U?#11.N8)
NetR_BA?#3_1: FPGA_2_PLEIADES (U?#4.P3), DDR3_PLEIADES (R_BA?#3.1 U?#11.M2)
NetR_CAS#?_1: FPGA_2_PLEIADES (U?#4.P8), DDR3_PLEIADES (R_CAS#?.1 U?#11.K3)
NetR_CKE?_2: FPGA_2_PLEIADES (U?#4.M9), DDR3_PLEIADES (R_CKE?.2 U?#11.K9)
NetR_ODT?_2: FPGA_2_PLEIADES (U?#4.P6), DDR3_PLEIADES (R_ODT?.2 U?#11.K1)
NetR_RAS#?_1: FPGA_2_PLEIADES (U?#4.N8), DDR3_PLEIADES (R_RAS#?.1 U?#11.J3)
NetR_RESET?_1: FPGA_2_PLEIADES (U?#4.L4), DDR3_PLEIADES (R_RESET?.1 U?#11.T2)
NetR_TDCT?#1_1: FPGA_2_PLEIADES (U?#3.AB18), ETHERNET_PLEIADES (R_TDCT?#1.1 U?#9.21)
NetR_TDCT?#2_1: FPGA_2_PLEIADES (U?#3.W17), ETHERNET_PLEIADES (R_TDCT?#2.1 U?#9.11)
NetR_WE#?_1: FPGA_2_PLEIADES (U?#4.P5), DDR3_PLEIADES (R_WE#?.1 U?#11.L3)
NetU?#3_AA17: FPGA_2_PLEIADES (U?#3.AA17), ETHERNET_PLEIADES (U?#9.23)
NetU?#3_AA18: FPGA_2_PLEIADES (U?#3.AA18), ETHERNET_PLEIADES (U?#9.31)
NetU?#3_AA19: FPGA_2_PLEIADES (U?#3.AA19 U?#3.AB17), ETHERNET_PLEIADES (U?#9.16 U?#9.24)
NetU?#3_AC15: FPGA_2_PLEIADES (U?#3.AC15), CLOCK_PLEIADES (U?#6.23)
NetU?#3_AC16: FPGA_2_PLEIADES (U?#3.AC16), CLOCK_PLEIADES (U?#6.25)
NetU?#3_AC17: FPGA_2_PLEIADES (U?#3.AC17 U?#3.AC19), ETHERNET_PLEIADES (U?#9.15 U?#9.25)
NetU?#3_AC20: FPGA_2_PLEIADES (U?#3.AC20), ETHERNET_PLEIADES (U?#9.18)
NetU?#3_AD14: FPGA_2_PLEIADES (U?#3.AD14), CLOCK_PLEIADES (U?#6.24)
NetU?#3_AD15: FPGA_2_PLEIADES (U?#3.AD15), CLOCK_PLEIADES (U?#6.12)
NetU?#3_AD16: FPGA_2_PLEIADES (U?#3.AD16 U?#3.AD19), ETHERNET_PLEIADES (U?#9.14 U?#9.26)
NetU?#3_AD17: FPGA_2_PLEIADES (U?#3.AD17), CLOCK_PLEIADES (U?#6.31)
NetU?#3_AD18: FPGA_2_PLEIADES (U?#3.AD18), ETHERNET_PLEIADES (U?#9.19)
NetU?#3_AD21: FPGA_2_PLEIADES (U?#3.AD21), ETHERNET_PLEIADES (U?#9.20)
NetU?#3_AE15: FPGA_2_PLEIADES (U?#3.AE15), ETHERNET_PLEIADES (U?#9.29)
NetU?#3_AE17: FPGA_2_PLEIADES (U?#3.AE17), CLOCK_PLEIADES (U?#6.22)
NetU?#3_AF15: FPGA_2_PLEIADES (U?#3.AF15), ETHERNET_PLEIADES (U?#9.22)
NetU?#3_AF16: FPGA_2_PLEIADES (U?#3.AF16 U?#3.V16), ETHERNET_PLEIADES (U?#9.13 U?#9.27)
NetU?#3_AF18: FPGA_2_PLEIADES (U?#3.AF18), ETHERNET_PLEIADES (U?#9.12)
NetU?#3_V15: FPGA_2_PLEIADES (U?#3.V15), CLOCK_PLEIADES (U?#6.14)
NetU?#3_Y16: FPGA_2_PLEIADES (U?#3.Y16), ETHERNET_PLEIADES (U?#9.28)
NetU?#4_AA1: FPGA_2_PLEIADES (U?#4.AA1), DDR3_PLEIADES (U?#11.C3)
NetU?#4_AA2: FPGA_2_PLEIADES (U?#4.AA2), DDR3_PLEIADES (U?#11.D7)
NetU?#4_AB1: FPGA_2_PLEIADES (U?#4.AB1), DDR3_PLEIADES (U?#11.A3)
NetU?#4_AB3: FPGA_2_PLEIADES (U?#4.AB3), DDR3_PLEIADES (U?#11.B8)
NetU?#4_AD1: FPGA_2_PLEIADES (U?#4.AD1), DDR3_PLEIADES (U?#11.A2)
NetU?#4_AD3: FPGA_2_PLEIADES (U?#4.AD3), DDR3_PLEIADES (U?#11.A7)
NetU?#4_AE1: FPGA_2_PLEIADES (U?#4.AE1), DDR3_PLEIADES (U?#11.C2)
NetU?#4_AE2: FPGA_2_PLEIADES (U?#4.AE2), DDR3_PLEIADES (U?#11.C8)
NetU?#4_T1: FPGA_2_PLEIADES (U?#4.T1), DDR3_PLEIADES (U?#11.H8)
NetU?#4_T3: FPGA_2_PLEIADES (U?#4.T3), DDR3_PLEIADES (U?#11.H3)
NetU?#4_U1: FPGA_2_PLEIADES (U?#4.U1), DDR3_PLEIADES (U?#11.H7)
NetU?#4_U2: FPGA_2_PLEIADES (U?#4.U2), DDR3_PLEIADES (U?#11.G2)
NetU?#4_V4: FPGA_2_PLEIADES (U?#4.V4), DDR3_PLEIADES (U?#11.D3)
NetU?#4_W1: FPGA_2_PLEIADES (U?#4.W1), DDR3_PLEIADES (U?#11.F8)
NetU?#4_W2: FPGA_2_PLEIADES (U?#4.W2), DDR3_PLEIADES (U?#11.F2)
NetU?#4_W3: FPGA_2_PLEIADES (U?#4.W3), DDR3_PLEIADES (U?#11.E7)
NetU?#4_Y1: FPGA_2_PLEIADES (U?#4.Y1), DDR3_PLEIADES (U?#11.F7)
NetU?#4_Y3: FPGA_2_PLEIADES (U?#4.Y3), DDR3_PLEIADES (U?#11.E3)